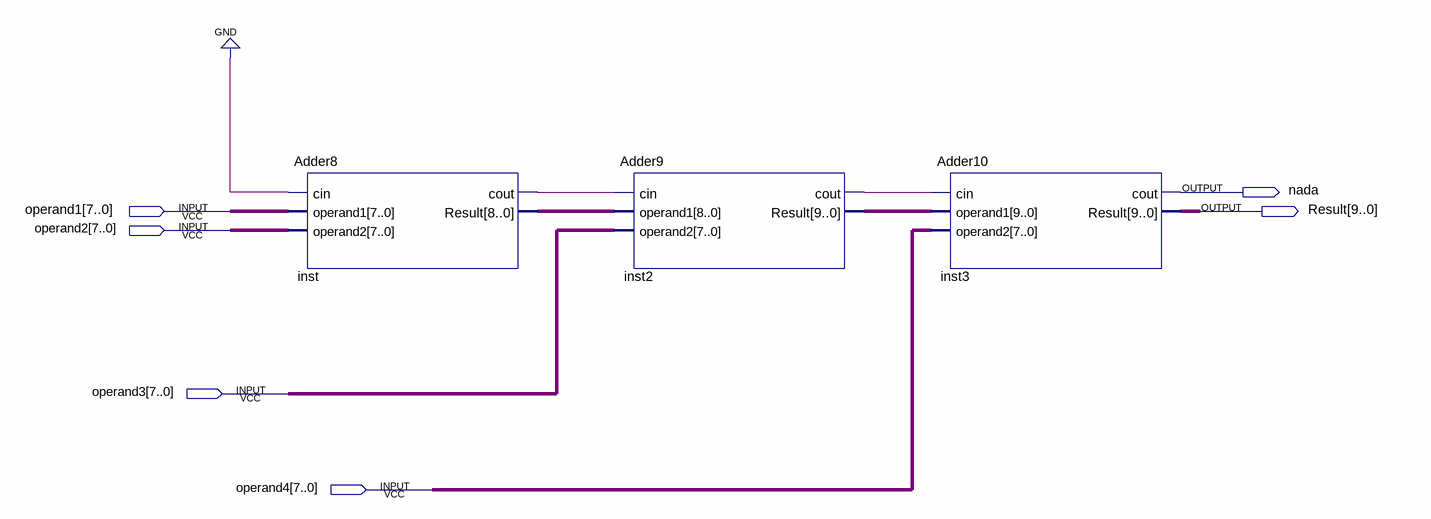
[diagram p0: schematic sheet]
// Quartus schematic AritmeticUnit.bdf as structural Verilog: 3 symbols, 6 pins
module AritmeticUnit (
  input  [7:0] operand1,
  input  [7:0] operand2,
  input  [7:0] operand3,
  input  [7:0] operand4,
  output nada,
  output [9:0] Result
);

  wire inst2_cout, inst_cout;
  wire [8:0] inst_result;
  wire [9:0] inst2_result;

  Adder8 inst (.cin(1'b0), .operand1(operand1), .operand2(operand2), .cout(inst_cout), .Result(inst_result));
  Adder9 inst2 (.cin(inst_cout), .operand1(inst_result), .operand2(operand3), .cout(inst2_cout), .Result(inst2_result));
  Adder10 inst3 (.cin(inst2_cout), .operand1(inst2_result), .operand2(operand4), .cout(nada), .Result(Result));
endmodule
